# EAGLE design Modular Assistive Technology Interface_v3 (EAGLE 9.6.2)
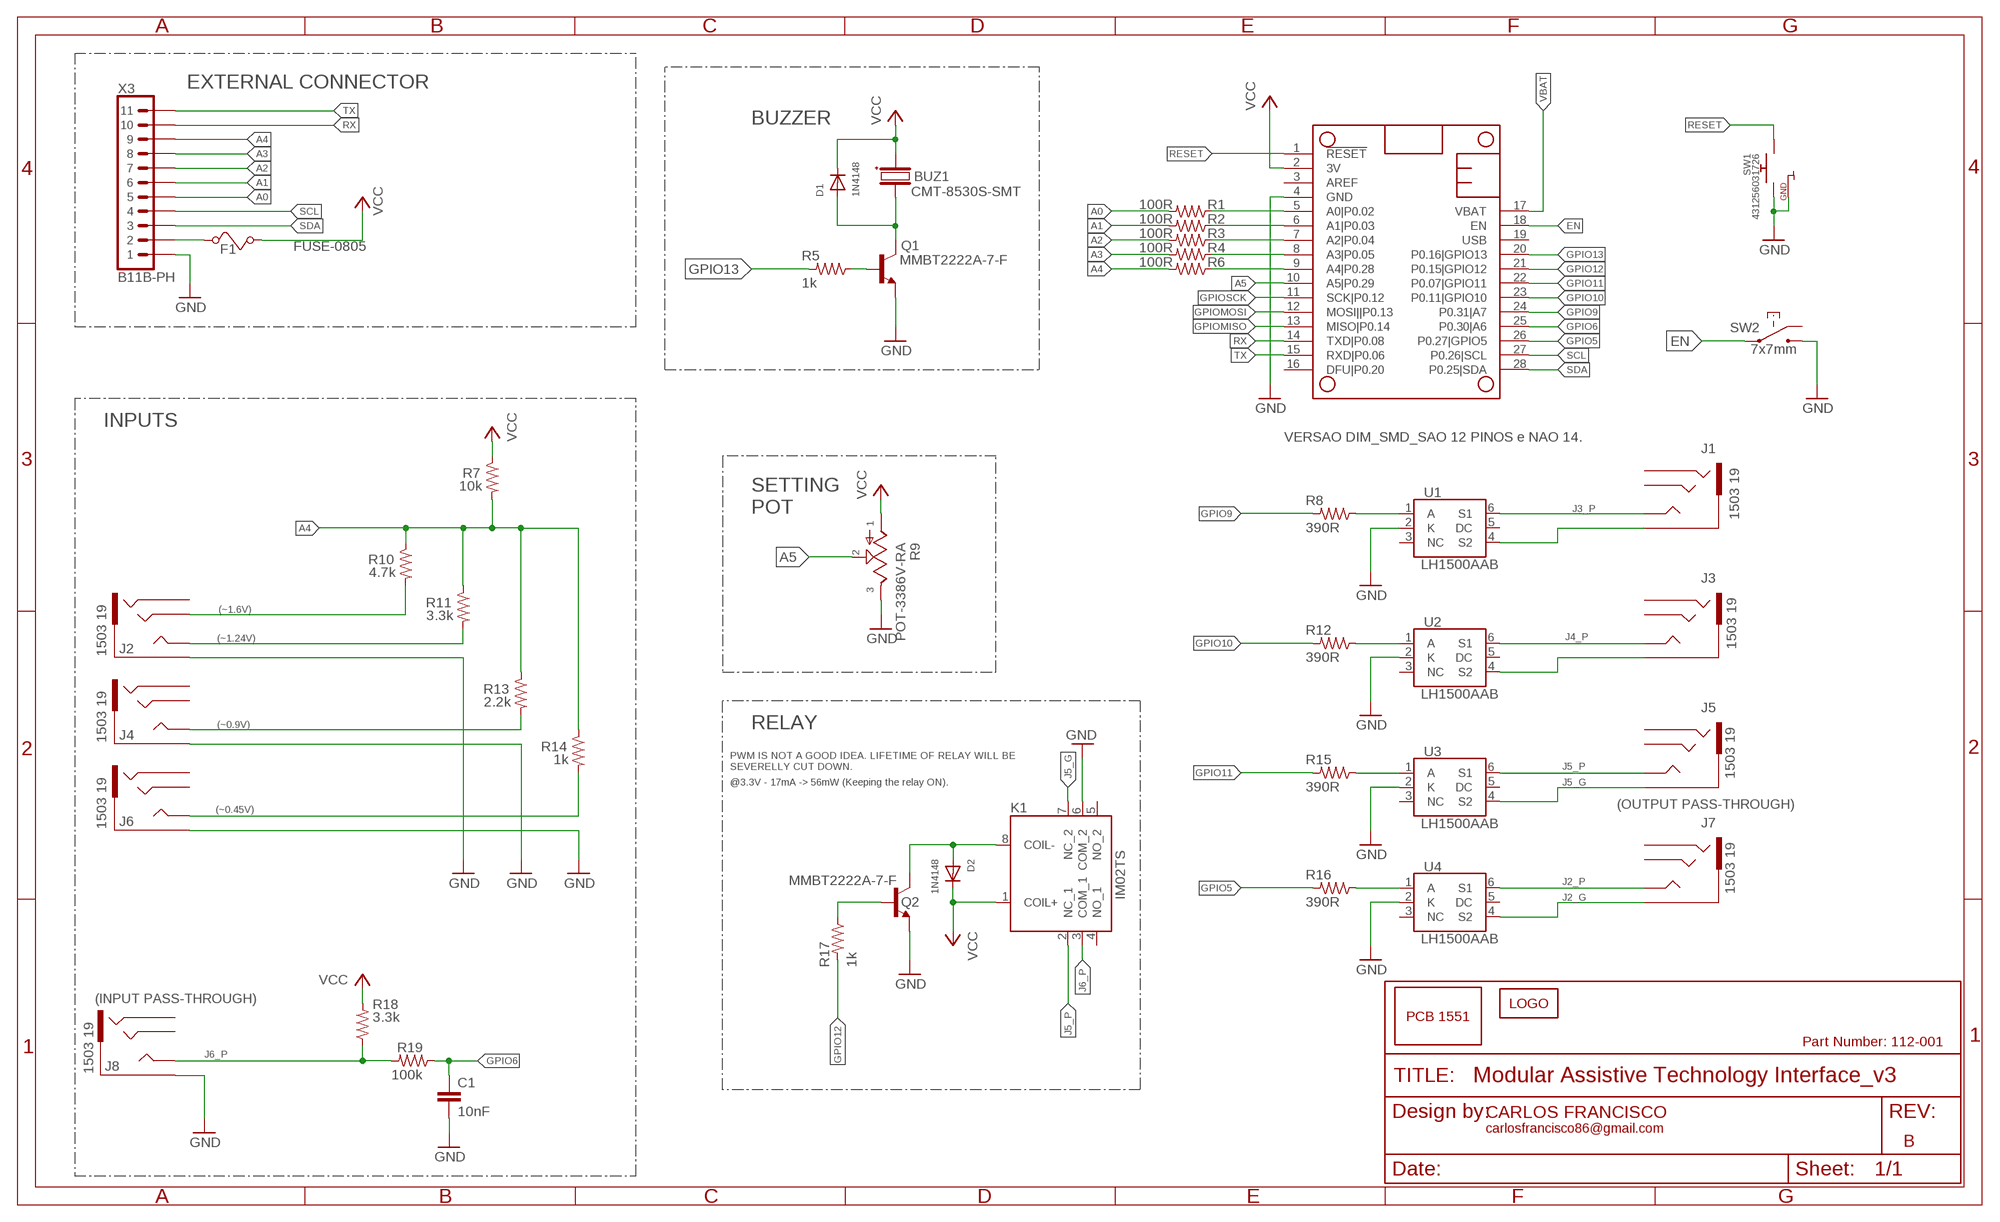
[diagram p0: schematic, sheet 1]

## Parts
BUZ1  CMT-8530S-SMT  BUZZER-CMT-8530S-SMT-TR  [CMT8530SSMTTR]
C1  10nF  C-10NF-50V-X7R-0603  [CAPC1608X85]
D1  1N4148  DIODE-75V-150MA-SOD-123  [SOD-123]
D2  1N4148  DIODE-75V-150MA-SOD-123  [SOD-123]
F1  FUSE-0805  [0ZCK0050AF2E]
J1  1503 19  STEREO_JACK-1503-19  [1503-19]
J2  1503 19  STEREO_JACK-1503-19  [1503-19]
J3  1503 19  STEREO_JACK-1503-19  [1503-19]
J4  1503 19  STEREO_JACK-1503-19  [1503-19]
J5  1503 19  STEREO_JACK-1503-19  [1503-19]
J6  1503 19  STEREO_JACK-1503-19  [1503-19]
J7  1503 19  STEREO_JACK-1503-19  [1503-19]
J8  1503 19  STEREO_JACK-1503-19  [1503-19]
K1  IM02TS  IM02TS  [IM03TS114620378]
LOGO1  LOGO-10MM  [LOGO_10MM]
MS1  FEATHERWING-NODIIM_SMD  [FEATHERWING_DIM_SMD]
PCB1  PCB_1551-V4  [PCB_V4]
Q1  MMBT2222A-7-F  NPN-40V-600MA-SOT23-3  [SOT-23]
Q2  MMBT2222A-7-F  NPN-40V-600MA-SOT23-3  [SOT-23]
R1  100R  R-100R-1%-0603  [R0603]
R2  100R  R-100R-1%-0603  [R0603]
R3  100R  R-100R-1%-0603  [R0603]
R4  100R  R-100R-1%-0603  [R0603]
R5  1k  R-1K-1%-0603  [R0603]
R6  100R  R-100R-1%-0603  [R0603]
R7  10k  R-10K-1%-0603  [R0603]
R8  390R  R-390R-1%-0603  [R0603]
R9  POT-3386V-RA  [3386V1103LF]
R10  4.7k  R-4.7K-1%-0603  [R0603]
R11  3.3k  R-3.3K-1%-0603  [R0603]
R12  390R  R-390R-1%-0603  [R0603]
R13  2.2k  R-2.2K-1%-0603  [R0603]
R14  1k  R-1K-1%-0603  [R0603]
R15  390R  R-390R-1%-0603  [R0603]
R16  390R  R-390R-1%-0603  [R0603]
R17  1k  R-1K-1%-0603  [R0603]
R18  3.3k  R-3.3K-1%-0603  [R0603]
R19  100k  R-100K-1%-0603  [R0603]
SW1  431256031726  SPST-RA  [SERIES95C_RA]
SW2  7x7mm  LATCHING_SWITCH-DPDT-7X7MM  [7X7MM_LATCHING]
U1  LH1500AAB  SSR-SMD-6  [SOT254P983X406-6N]
U2  LH1500AAB  SSR-SMD-6  [SOT254P983X406-6N]
U3  LH1500AAB  SSR-SMD-6  [SOT254P983X406-6N]
U4  LH1500AAB  SSR-SMD-6  [SOT254P983X406-6N]
X3  B11B-PH  CONN_11-B11B-PH  [SHDR6W50P0X200_1X11_990X450X600]

## Nets
A0: R1.1 X3.5
A0_R: MS1.5(A0|P0.02) R1.2
A1: R2.1 X3.6
A1_R: MS1.6(A1|P0.03) R2.2
A2: R3.1 X3.7
A2_R: MS1.7(A2|P0.04) R3.2
A3: R4.1 X3.8
A3_R: MS1.8(A3|P0.05) R4.2
A4: R6.1 R7.1 R10.2 R11.2 R13.2 R14.2 X3.9
A4_R: MS1.9(A4|P0.28) R6.2
A5: MS1.10(A5|P0.29) R9.2
BUZ_CTRL_R: Q1.B R5.2
EN: MS1.18(EN) SW2.P$2(C) SW2.P$5(C)
GND: C1.2 J2.1 J4.1 J6.1 J8.1 K1.6(COM_2) MS1.4(GND) Q1.E Q2.E R9.3 SW1.F1(GND) SW1.F2(GND) SW1.T2(SW2) SW2.P$1(NO) SW2.P$4(NO) U1.2(K) U2.2(K) U3.2(K) U4.2(K) X3.1
GPIO5: MS1.26(P0.27|GPIO5) R16.1
GPIO6: C1.1 MS1.25(P0.30|A6) R19.2
GPIO9: MS1.24(P0.31|A7) R8.1
GPIO10: MS1.23(P0.11|GPIO10) R12.1
GPIO11: MS1.22(P0.07|GPIO11) R15.1
GPIO12: MS1.21(P0.15|GPIO12) R17.1
GPIO13: MS1.20(P0.16|GPIO13) R5.1
GPIOMISO: MS1.13(MISO|P0.14)
GPIOMOSI: MS1.12(MOSI||P0.13)
GPIOSCK: MS1.11(SCK|P0.12)
IN1: J6.4 J6.5 R14.1
IN2: J4.4 J4.5 R13.1
IN3: J2.4 J2.5 R11.1
IN4: J2.3 R10.1
J2_G: J7.1 U4.4(S2)
J2_P: J7.4 J7.5 U4.6(S1)
J3_P: J1.4 J1.5 U1.6(S1)
J4_P: J3.4 J3.5 U2.6(S1)
J5_G: J5.1 K1.7(NC_2) U3.4(S2)
J5_P: J5.4 J5.5 K1.2(NC_1) U3.6(S1)
J6_P: J8.4 J8.5 K1.3(COM_1) R18.2 R19.1
N$1: BUZ1.3(-) D1.A Q1.C
N$2: J1.1 U1.4(S2)
N$3: J3.1 U2.4(S2)
N$6: R8.2 U1.1(A)
N$8: R12.2 U2.1(A)
N$9: R16.2 U4.1(A)
N$10: R15.2 U3.1(A)
N$13: F1.1 X3.2
N$14: D2.A K1.8(COIL-) Q2.C
N$19: Q2.B R17.2
RESET: MS1.1(!RESET) SW1.T1(SW1)
RX: MS1.14(TXD|P0.08) X3.10
SCL: MS1.27(P0.26|SCL) X3.4
SDA: MS1.28(P0.25|SDA) X3.3
TX: MS1.15(RXD|P0.06) X3.11
VBAT: MS1.17(VBAT)
VCC: BUZ1.2(+) D1.C D2.C F1.2 K1.1(COIL+) MS1.2(3V) R7.2 R9.1 R18.1
Unconnected: J1.2 J1.3 J2.2 J3.2 J3.3 J4.2 J4.3 J5.2 J5.3 J6.2 J6.3 J7.2 J7.3 J8.2 J8.3 K1.4(NO_1) K1.5(NO_2) MS1.3(AREF) MS1.16(DFU|P0.20) MS1.19(USB) SW2.P$3(NC) SW2.P$6(NC) U1.3(NC) U1.5(DC) U2.3(NC) U2.5(DC) U3.3(NC) U3.5(DC) U4.3(NC) U4.5(DC)

## Notes on the sheet
- EXTERNAL CONNECTOR
- BUZZER
- INPUTS
- VERSAO DIM_SMD_SAO 12 PINOS e NAO 14.
- SETTING
  POT
- (~1.6V)
- (~1.24V)
- (~0.9V) | RELAY
- PWM IS NOT A GOOD IDEA. LIFETIME OF RELAY WILL BE
  SEVERELLY CUT DOWN.
- @3.3V - 17mA -> 56mW (Keeping the relay ON).
- (OUTPUT PASS-THROUGH)
- (~0.45V)
- (INPUT PASS-THROUGH)
- Part Number: 112-001
- CARLOS FRANCISCO
- carlosfrancisco86@gmail.com
- B

## Library data of the parts
BUZ1 = RubenMiessen:BUZZER: Electromagnetic transducer buzzer
C1 = AceCenter:C; DESCRIPTION: CAP CER 10NF 50V X7R 0603; MFR: Samsung; MFR_NUM: CL10B103KB8WPJC; VENDOR: Digi-Key; VENDOR_NUM: 1276-CL10B103KB8WPJCCT-ND
D1 D2 = AceCenter:DIODE: General purpose diode; DESCRIPTION: DIODE GEN PURP 75V 150MA SOD123; MFR: Vishay; MFR_NUM: 1N4148W-G3-08; VENDOR: Digi-Key; VENDOR_NUM: 1N4148W-G3-08GICT-ND
F1 = AceCenter:FUSE
J1-J8 = AceCenter:STEREO_JACK: 3.5 mm PCB Mount Stereo Jack Socket; DESCRIPTION: Lumberg 3.5 mm PCB Mount Stereo Jack Socket, 4Pole 1A; MFR: Lumberg; MFR_NUM: 1503 19; VENDOR: RS-ONLINE; VENDOR_NUM: 124-8885
K1 = AceCenter:IM02TS: DPDT telecom PCB relay, 2A 5Vdc coil, EA Source: Datasheet <http://uk.rs-online.com/web/p/products/4227029>; DESCRIPTION: DPDT telecom PCB relay, 2A 5Vdc coil, EA; MANUFACTURER_NAME: TE Connectivity; MANUFACTURER_PART_NUMBER: IM03TS 1-1462037-8
LOGO1 = AceCenter:LOGO
MS1 = AceCenter:FEATHERWING
PCB1 = AceCenter:PCB_1551
Q1 Q2 = AceCenter:NPN; DESCRIPTION: TRANS NPN 40V 0.6A SMD SOT23-3; MFR: Diodes Incorporated; MFR_NUM: MMBT2222A-7-F; VENDOR: Digi-Key; VENDOR_NUM: MMBT2222A-FDICT-ND
R1-R4 R6 = AceCenter:R: SMD Resistor; DESCRIPTION: RES SMD 100 OHM 1% 1/10W 0603; MFR: Yageo; MFR_NUM: RC0603FR-07100RL; VENDOR_NUM: 311-100RHRCT-ND
R5 R14 R17 = AceCenter:R: SMD Resistor; DESCRIPTION: RES 1K OHM 0.1% 1/10W 0603; MFR: Yageo; MFR_NUM: RC0603FR-071KL; VENDOR_NUM: 311-1.00KHRCT-ND
R7 = AceCenter:R: SMD Resistor; DESCRIPTION: RES SMD 10K OHM 1% 1/10W 0603; MFR: Yageo; MFR_NUM: RC0603FR-0710KL; VENDOR_NUM: 311-10.0KHRCT-ND
R8 R12 R15 R16 = AceCenter:R: SMD Resistor; DESCRIPTION: RES SMD 390 OHM 5% 1/10W 0603; MFR: Yageo; MFR_NUM: RC0603JR-07390RL; VENDOR_NUM: 311-390GRCT-ND
R9 = AceCenter:POT: Bourns 3386P Series Through Hole Cermet Trimmer Resistor with Solder Pin Terminations, 20 +/-10% 0.5W +/-100ppm/C Source: Datasheet <https://www.bourns.com/docs/Product-Datasheets/3386.pdf>
R10 = AceCenter:R: SMD Resistor; DESCRIPTION: RES SMD 4.7K OHM 1% 1/10W 0603; MFR: Yageo; MFR_NUM: RC0603FR-074K7L; VENDOR_NUM: 311-4.70KHRCT-ND
R11 R18 = AceCenter:R: SMD Resistor; DESCRIPTION: RES SMD 3.3K OHM 1% 1/10W 0603; MFR: Yageo; MFR_NUM: RC0603FR-073K3L; VENDOR_NUM: 311-3.30KHRCT-ND
R13 = AceCenter:R: SMD Resistor; DESCRIPTION: RES SMD 2.2K OHM 1% 1/10W 0603; MFR: Yageo; MFR_NUM: RC0603FR-072K2L; VENDOR_NUM: 311-2.20KHRCT-ND
R19 = AceCenter:R: SMD Resistor; DESCRIPTION: RES SMD 100K OHM 1% 1/10W 0603; MFR: Yageo; MFR_NUM: RC0603FR-07100KL; VENDOR_NUM: 311-100KHRCT-ND
SW1 = AceCenter:SPST; DESCRIPTION: Tactile Switch, Single Pole Single Throw (SPST) 50 mA @ 12 V; MFR: Wurth Elektronik; MFR_NUM: 431256031726; VENDOR: RS-ONLINE; VENDOR_NUM: 785-6386
SW2 = AceCenter:LATCHING_SWITCH: Latching Switch; DESCRIPTION: SPDT Push Button Switch Self Latching Locking 3 Pin DIP PCB MOUNT 7 x 7mm; LINK: https://www.ebay.co.uk/itm/DPDT-Push-Button-Switch-Self-Latching-Locking-6-Pin-DIP-PCB-MOUNT-7-x-7mm/262950994955?hash=item3d3919c40b:g:PzUAAOSwHHFY~bUt
U1-U4 = AceCenter:SSR: Vishay 1 Form A Solid-State Relay (Normally Open); DESCRIPTION: SSR RELAY SPST-NO 150MA 0-350V; MFR: Vishay; MFR_NUM: LH1500AAB; VENDOR: Digi-Key; VENDOR_NUM: LH1500AAB-ND
X3 = AceCenter:CONN_11

## Board
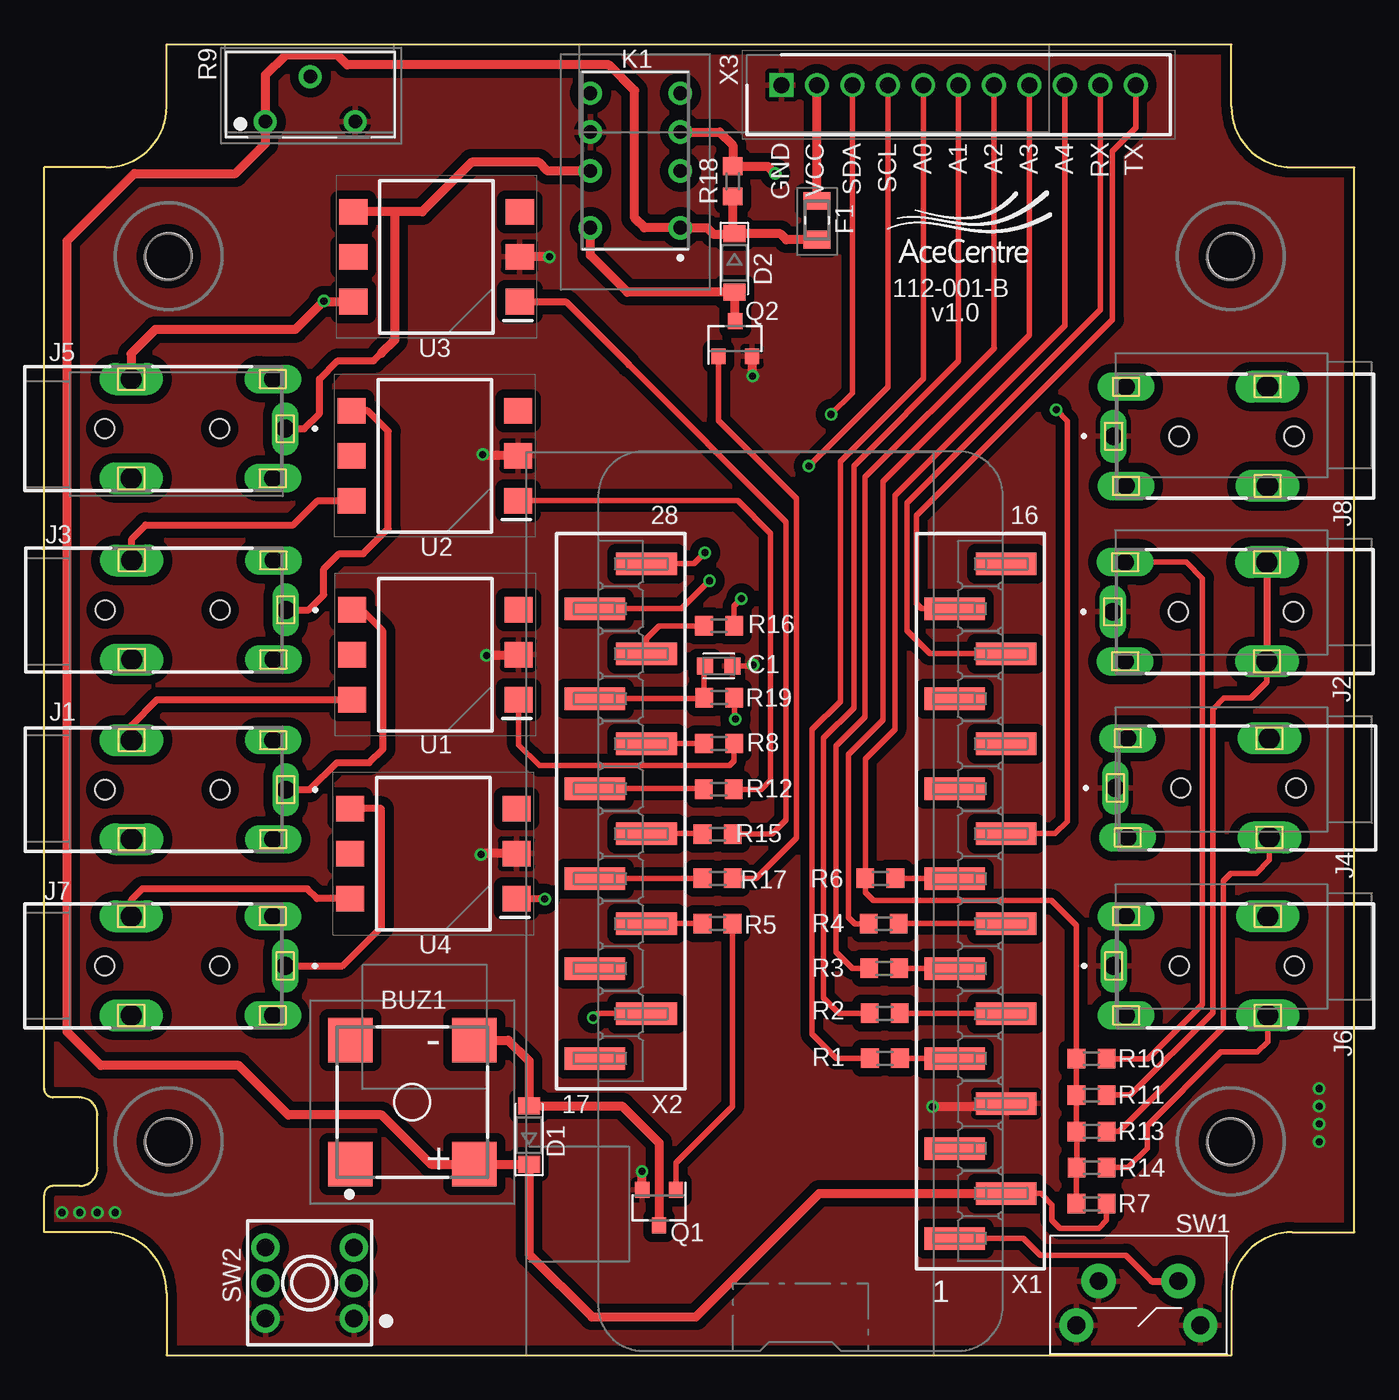
[diagram p1: board, top side]
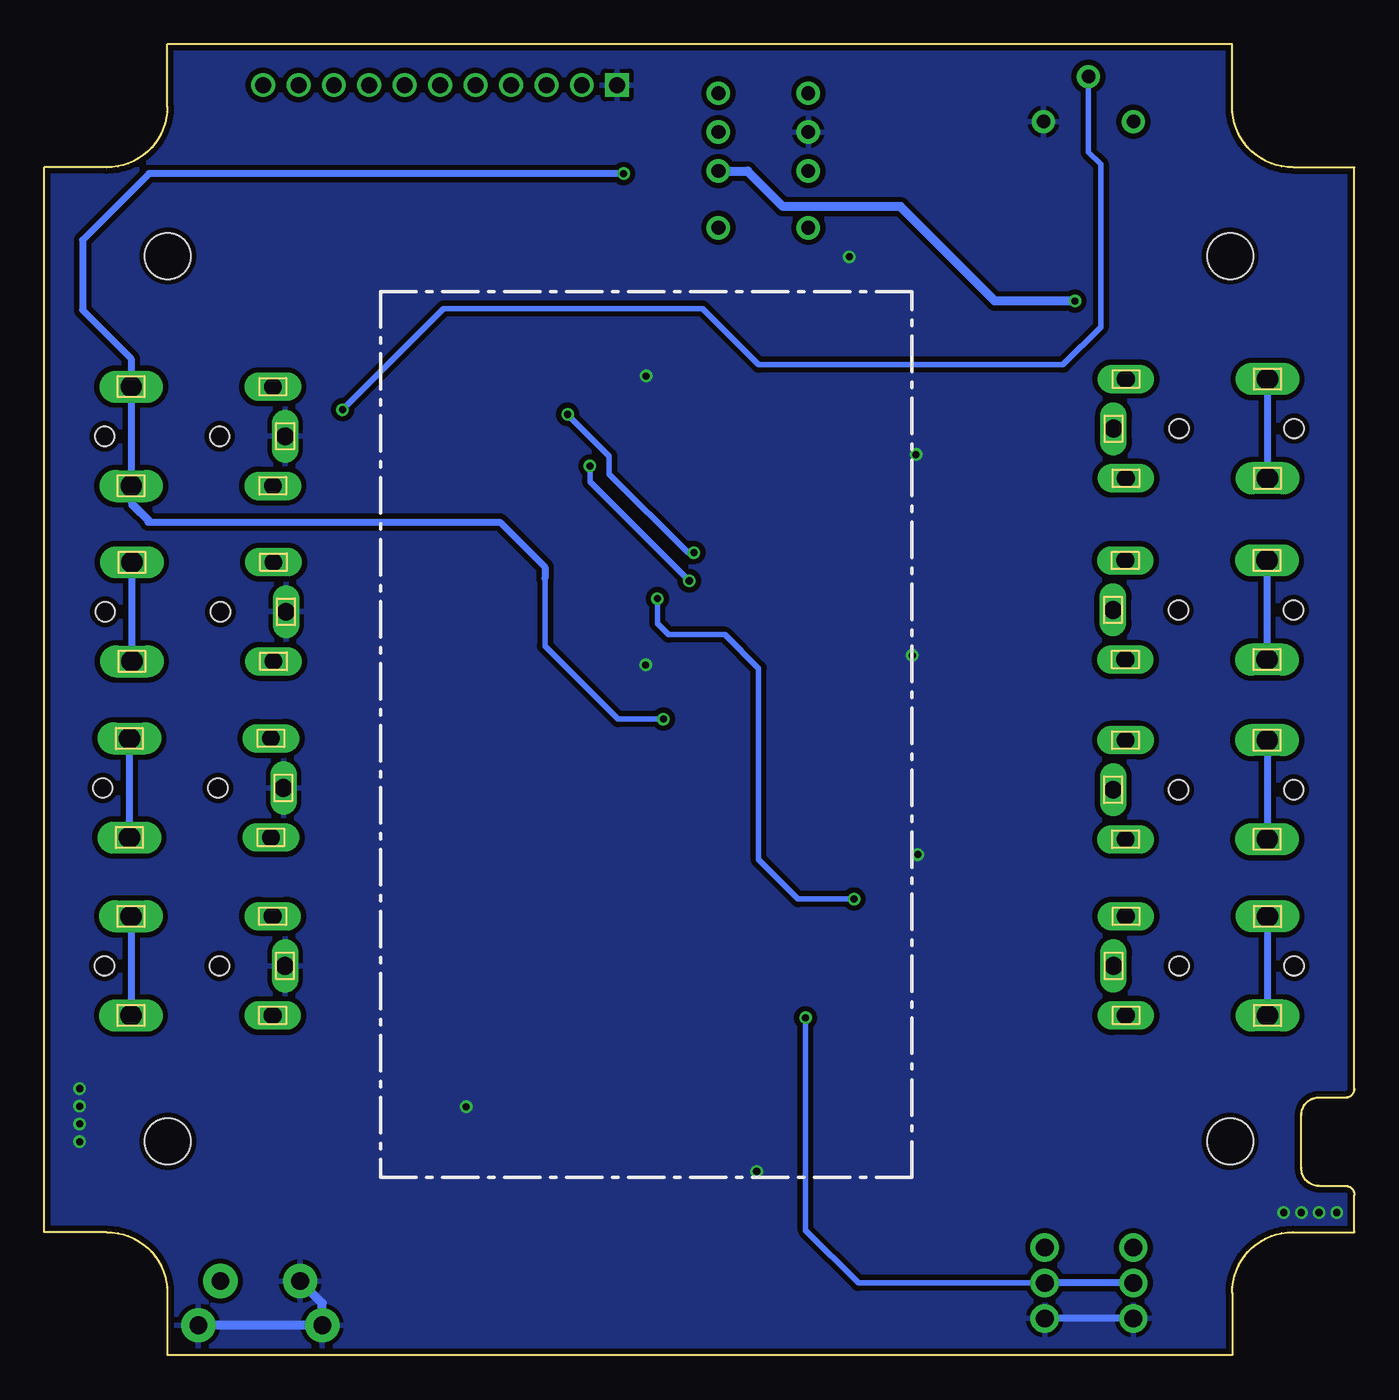
[diagram p2: board, bottom side, seen from below]

Size 74 x 74.04 mm. Coordinates in mm from the lower left corner, seen from the top.
Copper layers (1*16): Top 0.035mm / dielectric 1.5mm / Bottom 0.035mm
Design rules "SparkFun-2-layer-PCBWay-LIMIT": minimum track width 6mil, minimum drill 0.3mm, track to track 6mil, track to pad 6mil, pad to pad 6mil, via to via 6mil, smd to smd 6mil, copper to edge 6mil, drill to drill 6mil, minimum pad ring 6mil, minimum via ring 6mil, stop-mask expansion 4mil, vias tented up to drill 25mil, thermal gap 10mil

### Footprints (pad centres in the part's own frame; a part is rotated, then mirrored left to right if it is on the bottom)
CMT8530SSMTTR = smd 2.5 x 2.5: 1 -3.5,-3.5; 2 3.5,-3.5; 3 3.5,3.5; 4 -3.5,3.5
CAPC1608X85 = smd 0.921 x 0.97: 1 -0.775,0; 2 0.775,0
SOD-123 = smd 0.95 x 1.25: A 1.65,0; C -1.65,0
0ZCK0050AF2E = smd 1 x 1.5: 1 -1.1,0; 2 1.1,0
1503-19 = drill 1 pad 1.5 long: 1 14.7,0 | drill 1 pad 1.6 long: 2 14,2.8; 3 14,-2.8 | drill 1.2 pad 1.8 long: 4 6,2.8; 5 6,-2.8 | hole 1.1: 4.5,0; 11,0
IM03TS114620378 = drill 0.77 pad 1.32: 1 0,0; 2 3.2,0; 3 5.4,0; 4 7.6,0; 5 7.6,5.08; 6 5.4,5.08; 7 3.2,5.08; 8 0,5.08
FEATHERWING_DIM_SMD = smd 1.27 x 3.43: 1 6.35,2.73; 2 8.89,-0.19; 3 11.43,2.73; 4 13.97,-0.19; 5 16.51,2.73; 6 19.05,-0.19; 7 21.59,2.73; 8 24.13,-0.19; 9 26.67,2.73; 10 29.21,-0.19; 11 31.75,2.73; 12 34.29,-0.19; 13 36.83,2.73; 14 39.37,-0.19; 15 41.91,2.73; 16 44.45,-0.19; 17 16.51,23.05; 18 19.05,20.13; 19 21.59,23.05; 20 24.13,20.13; 21 26.67,23.05; 22 29.21,20.13; 23 31.75,23.05; 24 34.29,20.13; 25 36.83,23.05; 26 39.37,20.13; 27 41.91,23.05; 28 44.45,20.13
PCB_V4 = hole 2.6: 7.02,12.02; 67.02,12.02; 7.02,62.02; 67.02,62.02
SOT-23 = smd 0.8 x 0.9: B -0.95,-1; C 0,1; E 0.95,-1
R0603 = smd 1 x 1.1: 1 -0.85,0; 2 0.85,0
3386V1103LF = drill 0.76 pad 1.303: 1 0,0; 2 2.54,2.54; 3 5.08,0
SERIES95C_RA = drill 1 pad 1.93: F1 -3.5,2.5; F2 3.5,2.5; T1 -2.25,0; T2 2.25,0
7X7MM_LATCHING = drill 1 pad 1.6: P$1 -2,-2.5; P$2 0,-2.5; P$3 2,-2.5; P$4 -2,2.5; P$5 0,2.5; P$6 2,2.5
SOT254P983X406-6N = smd 1.6 x 1.45: 1 -4.7,2.54; 2 -4.7,0; 3 -4.7,-2.54; 4 4.7,-2.54; 5 4.7,0; 6 4.7,2.54
SHDR6W50P0X200_1X11_990X450X600 = drill 0.9 pad 1.35 square: 1 0,0 | drill 0.9 pad 1.35: 2 -2,0; 3 -4,0; 4 -6,0; 5 -8,0; 6 -10,0; 7 -12,0; 8 -14,0; 9 -16,0; 10 -18,0; 11 -20,0

### Placement (x,y rotation side)
BUZ1  20.79,14.29 0 top
C1  38.09,38.92 0 top
D1  27.38,12.43 90 top
D2  38.98,61.68 270 top
F1  43.64,64.1 270 top
J1  -1.07,31.94 0 top
J2  75.05,41.99 180 top
J3  -1.06,42.09 0 top
J4  75.19,32.04 180 top
J5  -1.09,52.33 0 top
J6  75.1,21.99 180 top
J7  -1.09,21.99 0 top
J8  75.09,51.9 180 top
K1  35.92,63.68 90 top
LOGO1  47.59,61.64 0 top
MS1  54.14,0.25 90 top
PCB1  0,0.06 0 top
Q1  34.72,8.33 180 top
Q2  39.02,57.41 0 top
R1  47.48,16.77 0 top
R2  47.46,19.31 0 top
R3  47.44,21.85 0 top
R4  47.41,24.37 0 top
R5  38.02,24.39 0 top
R6  47.22,26.93 0 top
R7  59.15,8.55 0 top
R8  38.11,34.55 0 top
R9  12.49,69.67 0 top
R10  59.14,16.74 180 top
R11  59.14,14.69 180 top
R12  38.1,31.96 0 top
R13  59.15,12.64 180 top
R14  59.16,10.6 180 top
R15  38.03,29.44 0 top
R16  38.11,41.19 0 top
R17  38.03,26.93 0 top
R18  38.89,66.3 90 top
R19  38.12,37.15 180 top
SW1  61.8,4.19 180 top
SW2  14.99,4.08 90 top
U1  22.09,39.57 180 top
U2  22.06,50.8 180 top
U3  22.15,62.04 180 top
U4  21.98,28.33 180 top
X3  41.64,71.74 180 top

### Tracks (layer width: path | path; a pad name or v marks a point on that pad's centre or on a via)
A0
  Top 0.3: R1.1 44.73,16.77 43.36,18.14 43.36,35.33 44.96,36.93 44.96,50.48 49.64,55.16 X3.5
A0_R
  Top 0.3: R1.2 MS1.5
A1
  Top 0.3: R2.1 44.88,19.31 44.02,20.18 44.02,34.85 45.72,36.56 45.72,50.22 51.64,56.14 X3.6
A1_R
  Top 0.3: R2.2 MS1.6
A2
  Top 0.3: R3.1 45.65,21.85 44.72,22.78 44.72,34.4 46.35,36.03 46.35,49.59 53.66,56.89 53.64,56.91 X3.7
A2_R
  Top 0.3: R3.2 MS1.7
A3
  Top 0.3: R4.1 45.78,24.37 45.43,24.72 45.43,33.93 47.37,35.87 47.37,49.33 55.64,57.6 X3.8
A3_R
  Top 0.3: MS1.8 R4.2
A4
  Top 0.3: X3.9 57.64,58.15 48.03,48.55 48.03,35.33 46.37,33.67 R6.1 46.37,26.13 46.82,25.68 56.89,25.68 58.29,24.28 R10.2 | 58.27,16.72 R10.2 | R11.2 58.27,14.71 | R13.2 | 58.33,10.62 R14.2 | R14.2 R7.1 | R13.2 58.3,12.63 R14.2 | R13.2 R11.2 | R11.2 R10.2
A4_R
  Top 0.3: MS1.9 R6.2
A5  (via drill 0.4)
  Top 0.3: MS1.10 57.08,29.46 57.78,30.16 57.78,52.77 v57.15,53.4
  Bottom 0.3: v57.15,53.4 51.44,59.11 36.83,59.11 33.66,55.94 16.45,55.94 14.34,58.06 14.34,67.27 15.03,67.96 R9.2
BUZ_CTRL_R
  Top 0.3: R5.2 38.87,14.06 35.67,10.86 Q1.B
EN  (via drill 0.4)
  Top 0.3: MS1.18 31.24,19.3 v31,19.06
  Bottom 0.3: SW2.P$2 28.02,4.08 31,7.06 v31,19.06
  Bottom 0.4: SW2.P$5 SW2.P$2
GND  (via drill 0.4)
  Top 0.3: v40.03,38.99 39.96,38.92 C1.2
  Top 0.5: v28.53,62.04 U3.2 | U3.2 | U2.2 24.83,50.8 v24.76,50.87 | MS1.4 54.14,14.03 v50.16,14.03 | Q1.E 33.77,10.37 v33.76,10.38 | U4.2 24.71,28.33 v24.66,28.28 | U1.2 26.75,39.53 v24.97,39.53 | Q2.E 39.97,55.34 v40.01,55.3
  Bottom 0.4: SW2.P$4 SW2.P$1
  Bottom 0.5: SW1.F1 SW1.F2 58.3,2.94 SW1.T2
  other vias: 72,15.06 72,14.06 72,13.06 72,12.06 1,8.06 2,8.06 4,8.06 3,8.06
  pour Bottom (isolate 0.3): 0,71.06 0,0.06 73,0.06 arc90 74,1.06 74,70.06 arc90 70,74.06 3,74.06 arc90
  pour Top (isolate 0.5): 74,71.06 74,0.06 1,0.06 arc-90 0,1.06 0,70.06 arc-90 4,74.06 71,74.06 arc-90
GPIO5
  Top 0.3: MS1.26 34.01,40.49 34.71,41.19 R16.1
GPIO6
  Top 0.3: MS1.25 37.2,37.08 R19.2 37.27,38.87 C1.1
GPIO9
  Top 0.3: MS1.24 R8.1
GPIO10
  Top 0.3: R12.1 37.21,32 MS1.23
GPIO11
  Top 0.3: R15.1 37.15,29.46 MS1.22
GPIO12
  Top 0.3: MS1.21 R17.1
GPIO13
  Top 0.3: R5.1 MS1.20
IN1
  Top 0.3: J6.4 69.1,17.7 68.52,17.12 66.46,17.12 62.3,12.96 62.3,11.69 61.21,10.6 R14.1
  Bottom 0.4: J6.5 J6.4
IN2
  Top 0.3: J4.4 69.19,27.96 68.45,27.22 67.02,27.22 66.6,26.8 66.6,18.53 60.7,12.63 60.01,12.63 R13.1
  Bottom 0.4: J4.5 J4.4
IN3
  Top 0.3: J2.4 69.05,38.79 69.05,38.03 68.13,37.11 66.63,37.11 65.99,36.47 65.99,19.33 61.35,14.69 R11.1
  Top 0.4: J2.5 69.05,38.79
  Bottom 0.4: J2.5 J2.4
IN4
  Top 0.3: R10.1 62.34,16.74 65.41,19.81 65.41,43.87 64.49,44.79 J2.3
J2_G
  Top 0.4: J7.1 16.85,21.99 19.05,24.19 19.05,30.87 U4.4
J2_P
  Top 0.4: U4.6 15.4,25.79 14.85,26.34 5.54,26.34 4.91,25.71 J7.4
  Bottom 0.4: J7.4 J7.5
J3_P
  Top 0.4: J1.4 4.93,35.58 6.38,37.03 U1.6
  Bottom 0.4: J1.4 J1.5
J4_P
  Top 0.4: 16.8,47.7 U2.6 15.44,48.26 14.07,46.89 5.72,46.89 4.94,46.11 J3.4
  Bottom 0.4: J3.4 J3.5
J5_G
  Top 0.4: J5.1 14.69,52.33 15.55,53.19 15.55,55.14 16.57,56.16 18.61,56.16 19.04,56.59
  Top 0.5: 19.7,64.58 19.79,64.49 19.79,57.34 19.04,56.59 | K1.7 28.43,66.88 27.94,67.37 24.13,67.37 21.34,64.58 19.7,64.58 | 19.7,64.58 U3.4
J5_P  (via drill 0.4)
  Top 0.5: U3.6 15.83,59.5 v15.79,59.54 14.18,57.93 6.27,57.93 4.9,56.56 J5.4
  Bottom 0.4: J5.4 J5.5
  Bottom 0.5: K1.2 34.28,66.88 32.27,64.87 25.64,64.87 20.31,59.54 v15.79,59.54
J6_P  (via drill 0.4)
  Top 0.3: R19.1 38.97,35.99 v39.03,35.93
  Top 0.5: K1.3 38.14,69.08 38.89,68.33 R18.2 40.86,67.15 v41.27,66.73
  Bottom 0.3: v39.03,35.93 41.59,35.93 45.72,40.06 45.72,43.87 | J8.4 69.09,48.95 69.09,48 68.14,47.05 67.94,47.05 48.26,47.05
  Bottom 0.4: J8.5 J8.4 69.09,48.19 67.94,47.05 | J8.5 69.09,56.28 71.84,59.03 71.84,62.98 68.08,66.73 v41.27,66.73 | J8.5 69.09,48.95 | 68.14,47.05 48.26,47.05 45.72,44.51 45.72,43.87
N$1
  Top 0.5: Q1.C 34.72,11.98 32.62,14.08 D1.A 27.38,16.62 26.2,17.79 BUZ1.3
N$2
  Top 0.4: J1.1 15,31.94 16.53,33.47 18.36,33.47 19.13,34.24 19.13,40.9 17.92,42.11 U1.4
N$3
  Top 0.4: J3.1 14.94,42.09 15.79,42.94 15.79,44.4 16.66,45.27 18.01,45.27 19.42,46.68 19.42,52.18 18.26,53.34 U2.4
N$6
  Top 0.3: R8.2 38.96,33.56 38.71,33.31 27.96,33.31 26.79,34.48 U1.1
N$8
  Top 0.3: R12.2 40.5,31.96 41.02,32.48 41.02,46.41 39.17,48.26 U2.1
N$9  (via drill 0.4)
  Top 0.3: v39.37,42.73 38.96,42.32 R16.2
  Top 0.4: U4.1 28.24,25.79 v28.26,25.77
  Bottom 0.3: v28.26,25.77 31.43,25.77 33.66,28 33.66,38.79 35.56,40.7 38.73,40.7 39.37,41.33 v39.37,42.73
N$10
  Top 0.3: R15.2 41.11,29.44 41.9,30.22 41.9,47.06 33.02,55.94
  Top 0.4: U3.1 29.46,59.5 33.02,55.94
N$13
  Top 0.5: F1.1 X3.2
N$14
  Top 0.5: Q2.C 38.98,58.45 D2.A 32.94,60.03 30.84,62.13 K1.8
N$19
  Top 0.3: Q2.B 38.07,52.79 42.48,48.38 42.48,29.2 40.2,26.93 R17.2
RESET
  Top 0.3: MS1.1 55.31,6.6 56.26,5.65 61.09,5.65 62.55,4.19
  Top 0.4: 62.55,4.19 SW1.T1
RX
  Top 0.3: MS1.14 50.02,39.62 48.71,40.92 48.71,48.12 59.64,59.05 X3.10
SCL  (via drill 0.4)
  Top 0.3: MS1.27 35.99,42.16 v37.57,43.74 | X3.4 47.64,54.68 v43.18,50.22
  Bottom 0.3: v43.18,50.22 43.18,49.35 v37.57,43.74
SDA  (via drill 0.4)
  Top 0.3: MS1.28 36.69,44.7 v37.31,45.32 | X3.3 45.64,54.34 v44.44,53.14
  Bottom 0.3: v44.44,53.14 v44.44,53.13 42.1,50.79 42.1,49.78 37.65,45.32 v37.31,45.32
TX
  Top 0.3: MS1.15 49.55,42.16 49.27,42.44 49.27,47.42 60.33,58.48 60.33,68 61.64,69.32 X3.11
VCC
  Top 0.3: R7.2 59.99,7.61 59.55,7.17 57.37,7.17 56.91,7.63 56.91,8.51 56.28,9.14 MS1.2
  Top 0.5: MS1.2 43.78,9.14 36.8,2.16 30.93,2.16 27.38,5.71 D1.C 27.37,10.79 BUZ1.2 21.84,10.79 19.06,13.57 13.78,13.57 10.99,16.36 3.19,16.36 1.27,18.28 1.27,62.92 5.08,66.73 10.79,66.73 12.49,68.43 R9.1 12.49,72.3 13.62,73.43 16.56,73.43 17.11,72.88 31.89,72.88 33.34,71.43 33.34,64.23 33.89,63.68 K1.1 37.43,63.68 37.8,63.31 38.95,63.31 D2.C | F1.2 41.91,63 41.58,63.33 D2.C | D2.C 38.89,63.43 R18.1

### Text on the board
tPlace: GND | VCC | SDA | SCL | A0 | A1 | A2 | A3 | A4 | RX | TX | 112-001-B | v1.0
tDocu: SDA | SCL | TX | GPIO5 | RX | GPIO6 | MISO | GPIO09 | MOSI | GPIO10 | SCK | GPIO11 | A5 | GPIO12 | A4 | GPIO13 | A3 | A2 | EN | A1 | VBAT | A0 | GND | VCC